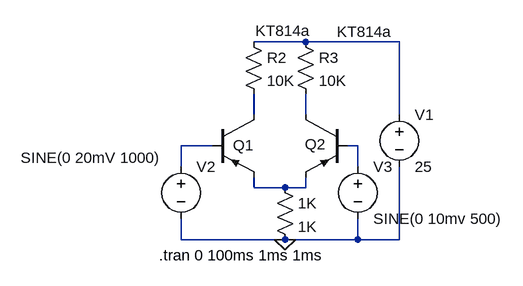
[diagram p0: schematic Long tailed pair with PNPs.asc]
Long tailed pair with PNPs.asc, the LTspice schematic file:
Version 4
SHEET 1 880 680
WIRE 208 0 128 0
WIRE 352 0 208 0
WIRE 128 112 128 80
WIRE 208 112 208 80
WIRE 352 112 352 0
WIRE 64 160 16 160
WIRE 288 160 272 160
WIRE 16 192 16 160
WIRE 288 192 288 160
WIRE 128 224 128 208
WIRE 176 224 128 224
WIRE 208 224 208 208
WIRE 208 224 176 224
WIRE 16 304 16 272
WIRE 176 304 16 304
WIRE 288 304 288 272
WIRE 288 304 176 304
WIRE 352 304 352 192
WIRE 352 304 288 304
FLAG 176 304 0
SYMBOL pnp 64 112 R0
WINDOW 0 32 47 Left 2
WINDOW 3 192 -128 Left 2
SYMATTR InstName Q1
SYMATTR Value KT814a
SYMBOL pnp 272 112 M0
WINDOW 0 33 45 Left 2
WINDOW 3 57 -129 Left 2
SYMATTR InstName Q2
SYMATTR Value KT814a
SYMBOL res 160 208 R0
SYMATTR InstName 1K
SYMATTR Value 1K
SYMBOL res 112 -16 R0
SYMATTR InstName R2
SYMATTR Value 10K
SYMBOL res 192 -16 R0
SYMATTR InstName R3
SYMATTR Value 10K
SYMBOL voltage 352 96 R0
WINDOW 123 0 0 Left 2
WINDOW 39 0 0 Left 2
SYMATTR InstName V1
SYMATTR Value 25
SYMBOL voltage 16 176 R0
WINDOW 3 -247 2 Left 2
WINDOW 123 0 0 Left 2
WINDOW 39 0 0 Left 2
SYMATTR InstName V2
SYMATTR Value SINE(0 20mV 1000)
SYMBOL voltage 288 176 R0
WINDOW 123 0 0 Left 2
WINDOW 39 0 0 Left 2
SYMATTR InstName V3
SYMATTR Value SINE(0 10mv 500)
TEXT -18 328 Left 2 !.tran 0 100ms 1ms 1ms

The netlist it stands for:
* Long tailed pair with PNPs.asc
Q1 N002 N004 N006 0 KT814a
Q2 N003 N005 N006 0 KT814a
R§1K N006 0 1K
R2 N001 N002 10K
R3 N001 N003 10K
V1 N001 0 25
V2 N004 0 SINE(0 20mV 1000)
V3 N005 0 SINE(0 10mv 500)
.model NPN NPN
.model PNP PNP
.lib standard.bjt
.tran 0 100ms 1ms 1ms
.backanno
.end